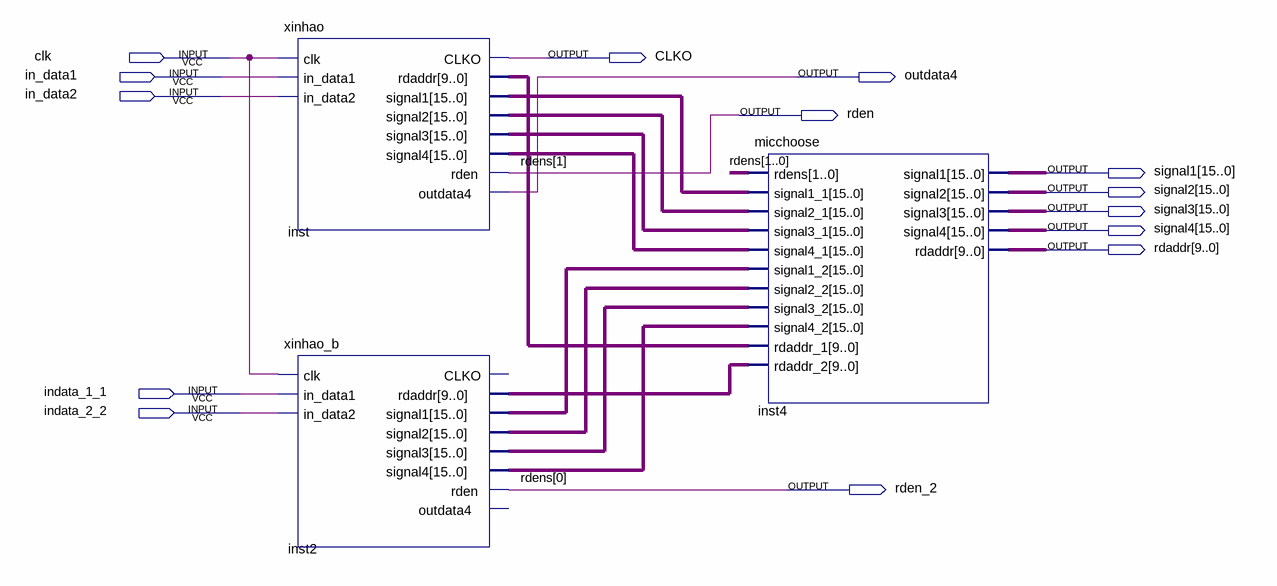
[diagram p0: schematic sheet]
// Quartus schematic micsig.bdf as structural Verilog: 3 symbols, 14 pins
module micsig (
  input  clk,
  input  in_data1,
  input  in_data2,
  input  indata_1_1,
  input  indata_2_2,
  output CLKO,
  output outdata4,
  output rden,
  output [15:0] signal1,
  output [15:0] signal2,
  output [15:0] signal3,
  output [15:0] signal4,
  output [9:0] rdaddr,
  output rden_2
);

  wire [9:0] inst2_rdaddr, inst_rdaddr;
  wire [15:0] inst2_signal1, inst2_signal2, inst2_signal3, inst2_signal4, inst_signal1, inst_signal2,
       inst_signal3, inst_signal4;

  xinhao inst (
    .clk(clk), .in_data1(in_data1), .in_data2(in_data2), .CLKO(CLKO), .rdaddr(inst_rdaddr),
    .signal1(inst_signal1), .signal2(inst_signal2), .signal3(inst_signal3), .signal4(inst_signal4),
    .rden(rden), .outdata4(outdata4));
  xinhao_b inst2 (
    .clk(clk), .in_data1(indata_1_1), .in_data2(indata_2_2), .rdaddr(inst2_rdaddr), .signal1(inst2_signal1),
    .signal2(inst2_signal2), .signal3(inst2_signal3), .signal4(inst2_signal4), .rden(rden_2));  // open: CLKO, outdata4
  micchoose inst4 (
    .rdens({rden, rden_2}), .signal1_1(inst_signal1), .signal2_1(inst_signal2), .signal3_1(inst_signal3),
    .signal4_1(inst_signal4), .signal1_2(inst2_signal1), .signal2_2(inst2_signal2),
    .signal3_2(inst2_signal3), .signal4_2(inst2_signal4), .rdaddr_1(inst_rdaddr), .rdaddr_2(inst2_rdaddr),
    .signal1(signal1), .signal2(signal2), .signal3(signal3), .signal4(signal4), .rdaddr(rdaddr));

  // Other names for the same wires on the sheet: rdens[1:0] = {rden, rden_2}
endmodule
